# Altium schematic sheet connectors.SchDoc
size A4
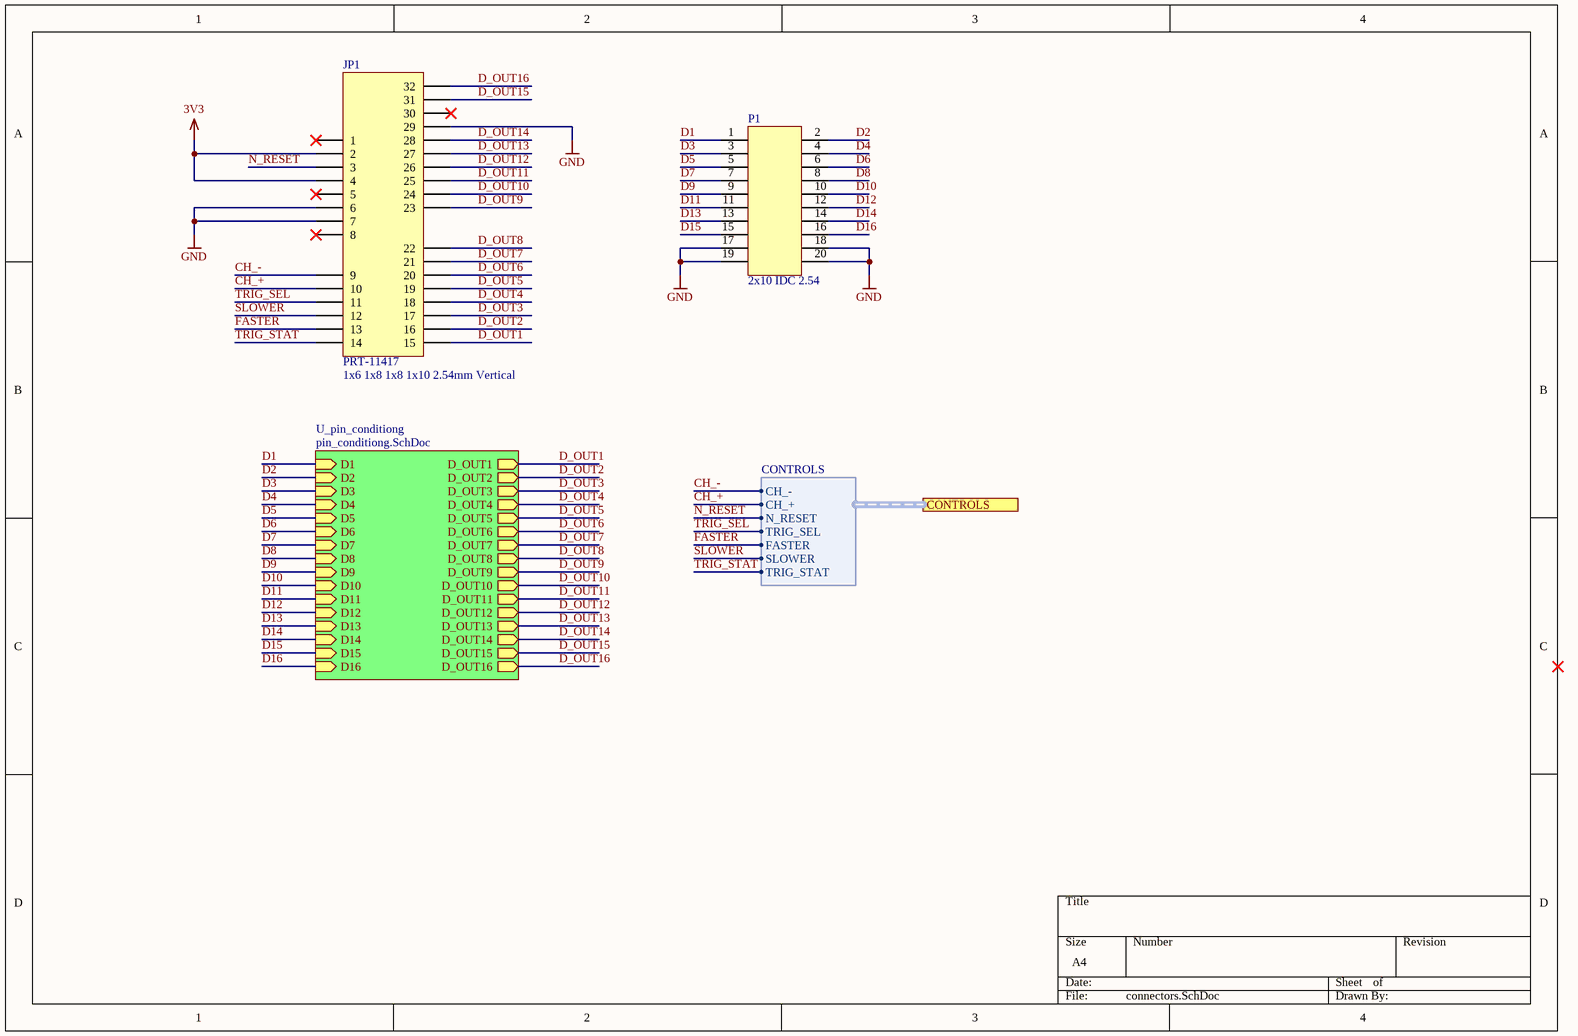
[diagram p0: connectors.SchDoc]

## Parts
JP1  value PRT-11417  SCH_Footprint: 1x6 1x8 1x8 1x10 2.54mm Vertical  [JP_ARDUINO_UNO_HEADER]  (hidden comment: Goldpin Male-Female straight)
P1  2x10 IDC 2.54  [J-LINK_20_pin_2.54]

## Sub-sheets
U_pin_conditiong = pin_conditiong.SchDoc: D1 (in), D2 (in), D3 (in), D4 (in), D5 (in), D6 (in), D7 (in), D8 (in), D9 (in), D10 (in), D11 (in), D12 (in), D13 (in), D14 (in), D15 (in), D16 (in), D_OUT1 (out), D_OUT2 (out), D_OUT3 (out), D_OUT4 (out), D_OUT5 (out), D_OUT6 (out), D_OUT7 (out), D_OUT8 (out), D_OUT9 (out), D_OUT10 (out), D_OUT11 (out), D_OUT12 (out), D_OUT13 (out), D_OUT14 (out), D_OUT15 (out), D_OUT16 (out)

## Ports
CONTROLS (harness CONTROLS)

## Harnesses
CONTROLS: CH_-, CH_+, N_RESET, TRIG_SEL, FASTER, SLOWER, TRIG_STAT

## Nets
3V3: JP1.2 JP1.4
GND: JP1.6 JP1.7 JP1.29 P1.17 P1.18 P1.19 P1.20
CH_+: JP1.10 ; port CONTROLS.CH_+
CH_-: JP1.9 ; port CONTROLS.CH_-
D1: P1.1 ; sheet U_pin_conditiong/D1
D2: P1.2 ; sheet U_pin_conditiong/D2
D3: P1.3 ; sheet U_pin_conditiong/D3
D4: P1.4 ; sheet U_pin_conditiong/D4
D5: P1.5 ; sheet U_pin_conditiong/D5
D6: P1.6 ; sheet U_pin_conditiong/D6
D7: P1.7 ; sheet U_pin_conditiong/D7
D8: P1.8 ; sheet U_pin_conditiong/D8
D9: P1.9 ; sheet U_pin_conditiong/D9
D10: P1.10 ; sheet U_pin_conditiong/D10
D11: P1.11 ; sheet U_pin_conditiong/D11
D12: P1.12 ; sheet U_pin_conditiong/D12
D13: P1.13 ; sheet U_pin_conditiong/D13
D14: P1.14 ; sheet U_pin_conditiong/D14
D15: P1.15 ; sheet U_pin_conditiong/D15
D16: P1.16 ; sheet U_pin_conditiong/D16
D_OUT1: JP1.15 ; sheet U_pin_conditiong/D_OUT1
D_OUT2: JP1.16 ; sheet U_pin_conditiong/D_OUT2
D_OUT3: JP1.17 ; sheet U_pin_conditiong/D_OUT3
D_OUT4: JP1.18 ; sheet U_pin_conditiong/D_OUT4
D_OUT5: JP1.19 ; sheet U_pin_conditiong/D_OUT5
D_OUT6: JP1.20 ; sheet U_pin_conditiong/D_OUT6
D_OUT7: JP1.21 ; sheet U_pin_conditiong/D_OUT7
D_OUT8: JP1.22 ; sheet U_pin_conditiong/D_OUT8
D_OUT9: JP1.23 ; sheet U_pin_conditiong/D_OUT9
D_OUT10: JP1.24 ; sheet U_pin_conditiong/D_OUT10
D_OUT11: JP1.25 ; sheet U_pin_conditiong/D_OUT11
D_OUT12: JP1.26 ; sheet U_pin_conditiong/D_OUT12
D_OUT13: JP1.27 ; sheet U_pin_conditiong/D_OUT13
D_OUT14: JP1.28 ; sheet U_pin_conditiong/D_OUT14
D_OUT15: JP1.31 ; sheet U_pin_conditiong/D_OUT15
D_OUT16: JP1.32 ; sheet U_pin_conditiong/D_OUT16
FASTER: JP1.13 ; port CONTROLS.FASTER
N_RESET: JP1.3 ; port CONTROLS.N_RESET
SLOWER: JP1.12 ; port CONTROLS.SLOWER
TRIG_SEL: JP1.11 ; port CONTROLS.TRIG_SEL
TRIG_STAT: JP1.14 ; port CONTROLS.TRIG_STAT

Not connected (* = marked no-connect by the designer): JP1 1* 5* 8* 30*

## Library data of the parts
JP1 = JP_ARDUINO_UNO_HEADER_1x6_1x8_1x8_1x10_2.54: Header 6-Pin, 8-Pin, 8-Pin, 10-Pin; Manufacturer: Sparkfun; Part Number: JP_ARDUINO_UNO_HEADER_1x6_1x8_1x8_1x10_2.54; Component Type: Standard; HelpURL: https://media.digikey.com/pdf/Data%20Sheets/Sparkfun%20PDFs/PRT-11417_Web.pdf; Manufacturer Part Number: PRT-11417; Supplier 1: TME; Supplier 2: RS Components; Supplier 3: Farnell; Supplier 4: Mouser; Supplier Part Number 4: 474-PRT-11417; Supplier 5: Digi-Key; Supplier Part Number 5: 1568-1413-ND
P1 = Header_2x10_2.54_Shrouded